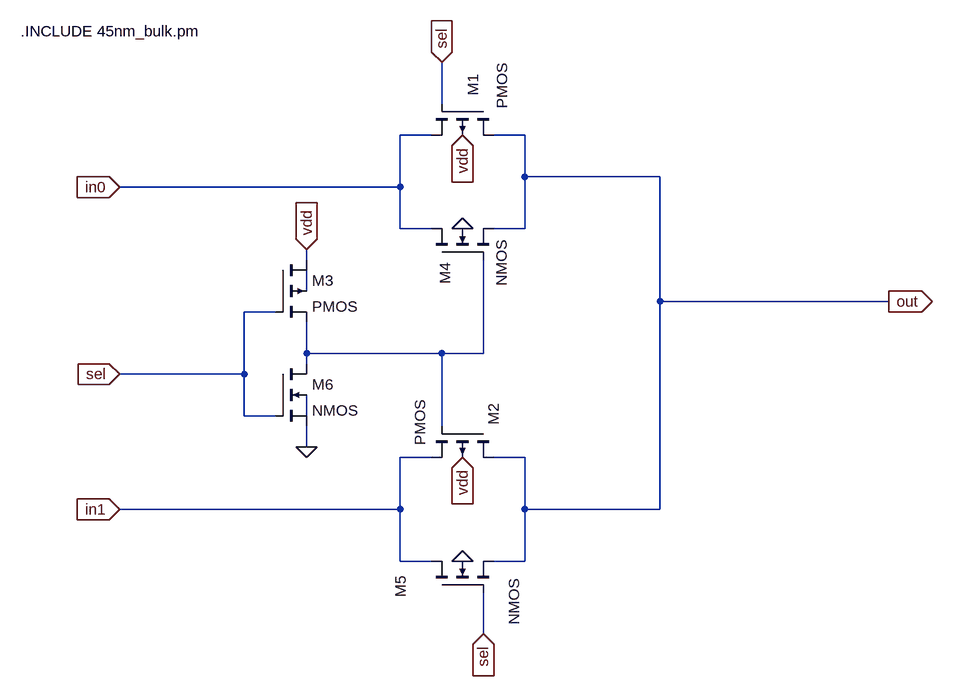
[diagram p0: schematic mux2to1.asc]
mux2to1.asc, the LTspice schematic file:
Version 4
SHEET 1 1536 924
WIRE 544 16 544 -48
WIRE 528 64 480 64
WIRE 672 64 624 64
WIRE 672 128 672 64
WIRE 880 128 672 128
WIRE 480 144 480 64
WIRE 480 144 48 144
WIRE 480 208 480 144
WIRE 528 208 480 208
WIRE 672 208 672 128
WIRE 672 208 624 208
WIRE 336 256 336 240
WIRE 336 304 336 272
WIRE 880 320 880 128
WIRE 1232 320 880 320
WIRE 288 336 240 336
WIRE 336 400 336 352
WIRE 544 400 336 400
WIRE 608 400 608 256
WIRE 608 400 544 400
WIRE 336 416 336 400
WIRE 240 432 240 336
WIRE 240 432 48 432
WIRE 240 496 240 432
WIRE 288 496 240 496
WIRE 336 496 336 464
WIRE 544 512 544 400
WIRE 336 544 336 512
WIRE 528 560 480 560
WIRE 672 560 624 560
WIRE 480 640 480 560
WIRE 480 640 48 640
WIRE 672 640 672 560
WIRE 880 640 880 320
WIRE 880 640 672 640
WIRE 480 720 480 640
WIRE 528 720 480 720
WIRE 672 720 672 640
WIRE 672 720 624 720
WIRE 608 832 608 768
FLAG 544 -48 sel
IOPIN 544 -48 In
FLAG 608 832 sel
IOPIN 608 832 In
FLAG 48 432 sel
IOPIN 48 432 In
FLAG 48 144 in0
IOPIN 48 144 In
FLAG 48 640 in1
IOPIN 48 640 In
FLAG 1232 320 out
IOPIN 1232 320 Out
FLAG 336 240 vdd
IOPIN 336 240 In
FLAG 336 544 0
FLAG 576 64 vdd
IOPIN 576 64 In
FLAG 576 560 vdd
IOPIN 576 560 In
FLAG 576 208 0
FLAG 576 720 0
SYMBOL pmos4 624 16 R90
WINDOW 0 -46 32 Left 2
WINDOW 3 -63 -13 Left 2
SYMATTR InstName M1
SYMATTR Value2 l=45n w=45n
SYMBOL pmos4 624 512 R90
WINDOW 0 -35 0 Left 2
WINDOW 3 -40 113 Left 2
SYMATTR InstName M2
SYMATTR Value2 l=45n w=45n
SYMBOL pmos4 288 256 R0
SYMATTR InstName M3
SYMATTR Value2 l=45n w=45n
SYMBOL nmos4 528 256 R270
WINDOW 0 -38 21 Left 2
WINDOW 3 -41 108 Left 2
SYMATTR InstName M4
SYMATTR Value2 l=45n w=45n
SYMBOL nmos4 528 768 R270
WINDOW 0 -8 -47 Left 2
WINDOW 3 -50 127 Left 2
SYMATTR InstName M5
SYMATTR Value2 l=45n w=45n
SYMBOL nmos4 288 416 R0
SYMATTR InstName M6
SYMATTR Value2 l=45n w=45n
TEXT -104 -96 Left 2 !.INCLUDE 45nm_bulk.pm

The netlist it stands for:
* mux2to1.asc
M1 out sel in0 vdd PMOS l=45n w=45n
M2 out N002 in1 vdd PMOS l=45n w=45n
M3 vdd sel N002 N001 PMOS l=45n w=45n
M4 in0 N002 out 0 NMOS l=45n w=45n
M5 in1 sel out 0 NMOS l=45n w=45n
M6 N002 sel 0 N003 NMOS l=45n w=45n
.model NMOS NMOS
.model PMOS PMOS
.lib standard.mos
.INCLUDE 45nm_bulk.pm
.backanno
.end